# Altium project dc-dc stepup converter.PrjPCB
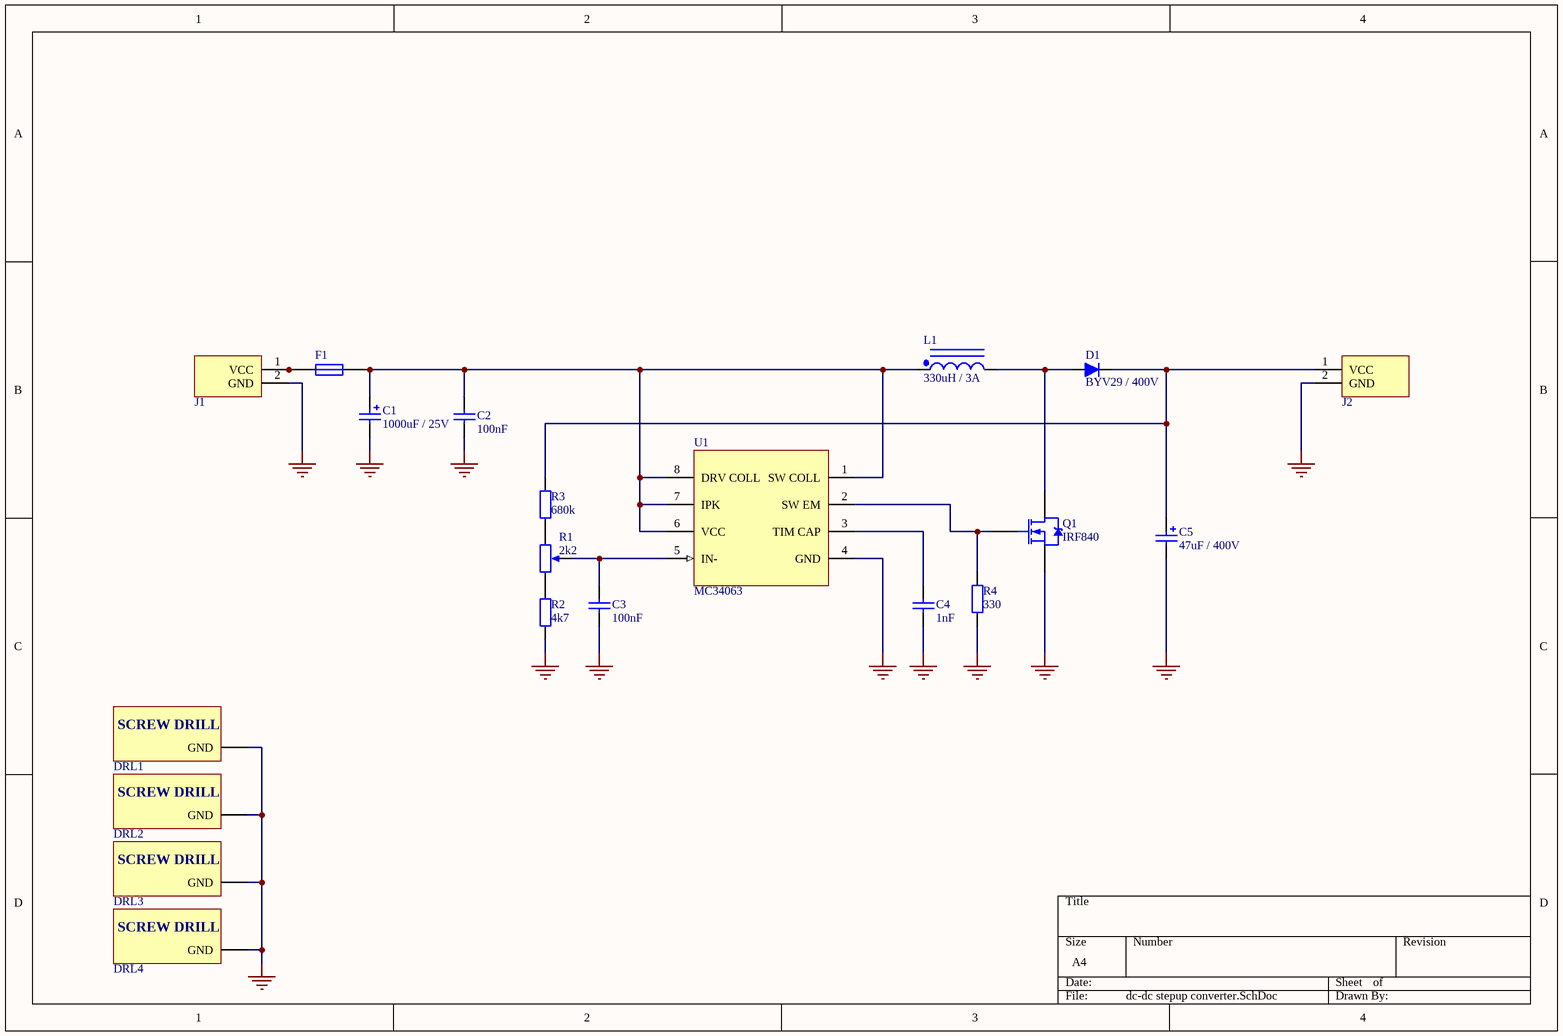
[diagram p0: dc-dc stepup converter.SchDoc]
1 sheet, 20 parts. Net scope: global (net labels, ports and power ports of the same name join across sheets).
Board file: dc-dc stepup converter.PcbDoc

## Sheet dc-dc stepup converter.SchDoc
size A4

### Parts
C1  1000uF / 25V  [CAPPR5-10x20_MANUAL]
C2  100nF  [CAPR5.08-7.8X3.2_MANUAL]
C3  100nF  [CAPR5.08-7.8X3.2_MANUAL]
C4  1nF  [CAPR5.08-7.8X3.2_MANUAL]
C5  47uF / 400V  [CAPPR7.5-16.5x30_MANUAL]
D1  BYV29 / 400V  [TO220/2]
DRL1  SCREW DRILL  [3mm screw drill I]  (value not drawn)
DRL2  SCREW DRILL  [3mm screw drill I]  (value not drawn)
DRL3  SCREW DRILL  [3mm screw drill I]  (value not drawn)
DRL4  SCREW DRILL  [3mm screw drill I]  (value not drawn)
F1  (no value)  [Bezp 5x20 uniw]
J1  ARK2_power  [ARK2/3.5mm pitch]  (value not drawn)
J2  ARK2_power  [ARK2/3.5mm pitch]  (value not drawn)
L1  330uH / 3A  [IND_15.4_PIONOWO]
Q1  IRF840  [TO220]
R1  2k2  [RPot_wieloob_19mm_lezacy]
R2  4k7  [RES10.55-7X2.8_MANUAL]
R3  680k  [RES10.55-7X2.8_MANUAL]
R4  330  [RES10.55-7X2.8_MANUAL]
U1  MC34063  [DIP8_MANUAL]

### Nets
GND: C1.2 C2.1 C3.1 C4.1 C5.2 DRL1.0(GND) DRL2.0(GND) DRL3.0(GND) DRL4.0(GND) J1.2(GND) J2.2(GND) Q1.3(S) R2.1 R4.1 U1.4(GND)
NetC1_1: C1.1 C2.2 F1.2 F1.4 F1.6 F1.8 L1.1 U1.1(SW_COLL) U1.6(VCC) U1.7(IPK) U1.8(DRV_COLL)
NetC3_2: C3.2 R1.3(TAP) U1.5(IN-)
NetC4_2: C4.2 U1.3(TIM_CAP)
NetC5_1: C5.1 D1.2(K) J2.1(VCC) R3.2
NetD1_1: D1.1(A) L1.2 Q1.2(D)
NetF1_1: F1.1 F1.3 F1.5 F1.7 J1.1(VCC)
NetQ1_1: Q1.1(G) R4.2 U1.2(SW_EM)
NetR1_1: R1.1(TOP) R2.2
NetR1_2: R1.2(BOT) R3.1

### Library data of the parts
C1 C5 = Cap Pol: Polarized Capacitor; Published: 20-Feb-2006
  C1: Value: 1000uF / 25V
  C5: Value: 47uF / 400V
C2-C4 = Cap: Capacitor; Published: 19-Feb-2006
  C2 C3: Value: 100nF
  C4: Value: 1nF
D1 = BYV29: Rectifier diodes ultrafast; pin to pad: 1>2 2>1; Published: 07-May-2007
F1 = Fuse: Published: 20-Mar-2006
L1 = InducCore: Magnetic-Core Inductor with Winding Polarity Marking; Published: 08-Mar-2006; Value: 330uH / 3A
Q1 = IRF840: N-Channel Power MOSFET; Published: 22-Jan-2007; Package Reference: TO-220
R1 = RPot: Potentiometer; Published: 03-Apr-2006; Value: 2k2
R2-R4 = Res: Resistor; Published: 19-Feb-2006
  R2: Value: 4k7
  R3: Value: 680k
  R4: Value: 330
U1 = MC34063: DC-to-DC Converter Control Circuit; Published: 22-Nov-2006; PackageReference: SO8